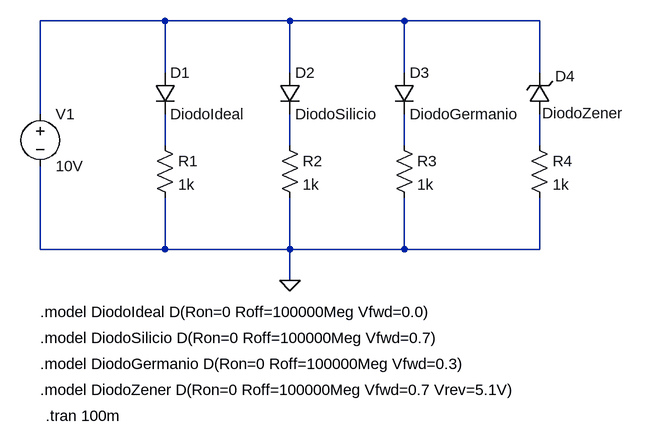
[diagram p0: schematic P1A02-DiodoIdeal-LTspice.asc]
P1A02-DiodoIdeal-LTspice.asc, the LTspice schematic file:
Version 4
SHEET 1 1584 7420
WIRE 112 16 -80 16
WIRE 304 16 112 16
WIRE 480 16 304 16
WIRE 688 16 480 16
WIRE 112 96 112 16
WIRE 304 96 304 16
WIRE 480 96 480 16
WIRE 688 96 688 16
WIRE -80 160 -80 16
WIRE 112 208 112 160
WIRE 304 208 304 160
WIRE 480 208 480 160
WIRE 688 208 688 160
WIRE -80 368 -80 240
WIRE 112 368 112 288
WIRE 112 368 -80 368
WIRE 304 368 304 288
WIRE 304 368 112 368
WIRE 480 368 480 288
WIRE 480 368 304 368
WIRE 688 368 688 288
WIRE 688 368 480 368
WIRE 304 416 304 368
FLAG 304 416 0
SYMBOL res 96 192 R0
SYMATTR InstName R1
SYMATTR Value 1k
SYMBOL voltage -80 144 R0
WINDOW 123 0 0 Left 2
WINDOW 39 0 0 Left 2
SYMATTR InstName V1
SYMATTR Value 10V
SYMBOL res 288 192 R0
SYMATTR InstName R2
SYMATTR Value 1k
SYMBOL diode 96 96 R0
SYMATTR InstName D1
SYMATTR Value DiodoIdeal
SYMBOL diode 288 96 R0
SYMATTR InstName D2
SYMATTR Value DiodoSilicio
SYMBOL res 464 192 R0
SYMATTR InstName R3
SYMATTR Value 1k
SYMBOL diode 464 96 R0
SYMATTR InstName D3
SYMATTR Value DiodoGermanio
SYMBOL res 672 192 R0
SYMATTR InstName R4
SYMATTR Value 1k
SYMBOL zener 704 160 R180
WINDOW 0 -39 59 Left 2
WINDOW 3 -115 2 Left 2
SYMATTR InstName D4
SYMATTR Value DiodoZener
TEXT -72 624 Left 2 !.tran 100m
TEXT -80 464 Left 2 !.model DiodoIdeal D(Ron=0 Roff=100000Meg Vfwd=0.0)
TEXT -80 504 Left 2 !.model DiodoSilicio D(Ron=0 Roff=100000Meg Vfwd=0.7)
TEXT -80 544 Left 2 !.model DiodoGermanio D(Ron=0 Roff=100000Meg Vfwd=0.3)
TEXT -80 584 Left 2 !.model DiodoZener D(Ron=0 Roff=100000Meg Vfwd=0.7 Vrev=5.1V)

The netlist it stands for:
* P1A02-DiodoIdeal-LTspice.asc
R1 N002 0 1k
V1 N001 0 10V
R2 N003 0 1k
D1 N001 N002 DiodoIdeal
D2 N001 N003 DiodoSilicio
R3 N004 0 1k
D3 N001 N004 DiodoGermanio
R4 N005 0 1k
D4 N005 N001 DiodoZener
.model D D
.lib standard.dio
.tran 100m
.model DiodoIdeal D(Ron=0 Roff=100000Meg Vfwd=0.0)
.model DiodoSilicio D(Ron=0 Roff=100000Meg Vfwd=0.7)
.model DiodoGermanio D(Ron=0 Roff=100000Meg Vfwd=0.3)
.model DiodoZener D(Ron=0 Roff=100000Meg Vfwd=0.7 Vrev=5.1V)
.backanno
.end